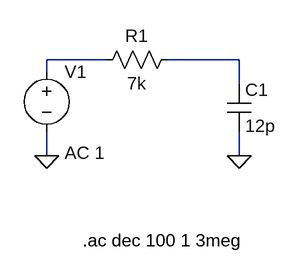
[diagram p0: schematic Draft1.asc]
Draft1.asc, the LTspice schematic file:
Version 4
SHEET 1 880 680
WIRE 80 112 0 112
WIRE 256 112 160 112
WIRE 0 128 0 112
WIRE 256 144 256 112
WIRE 0 240 0 208
WIRE 256 240 256 208
FLAG 256 240 0
FLAG 0 240 0
SYMBOL res 176 96 R90
WINDOW 0 0 56 VBottom 2
WINDOW 3 32 56 VTop 2
SYMATTR InstName R1
SYMATTR Value 7k
SYMBOL cap 240 144 R0
SYMATTR InstName C1
SYMATTR Value 12p
SYMBOL voltage 0 112 R0
WINDOW 3 24 152 Invisible 2
WINDOW 123 24 124 Left 2
WINDOW 39 0 0 Left 0
SYMATTR InstName V1
SYMATTR Value SINE(0 1 1k)
SYMATTR Value2 AC 1
TEXT 48 352 Left 2 !.ac dec 100 1 3meg

The netlist it stands for:
* Draft1.asc
R1 N002 N001 7k
C1 N002 0 12p
V1 N001 0 SINE(0 1 1k) AC 1
.ac dec 100 1 3meg
.backanno
.end